# EAGLE design V2_7.7 (EAGLE 7.7.0)
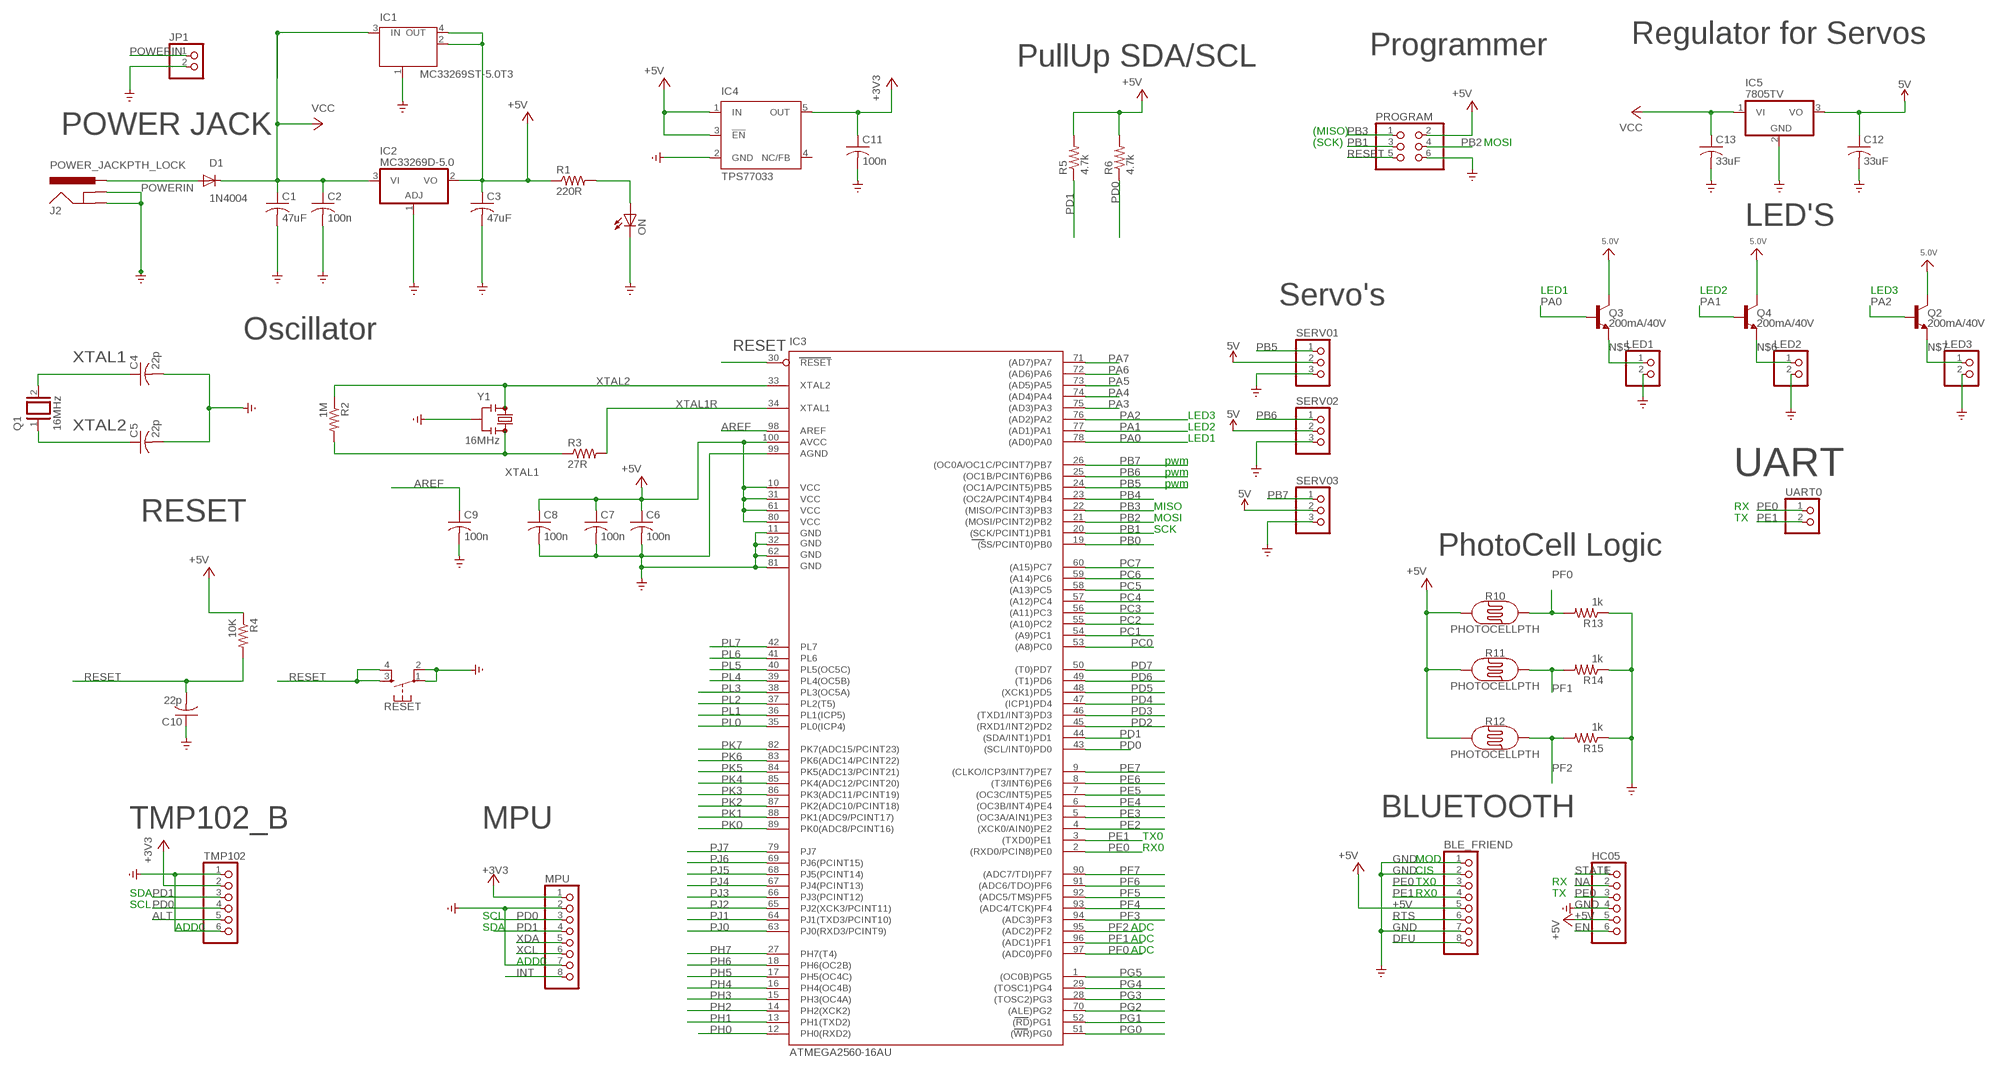
[diagram p0: schematic, sheet 1, part 1 of 2]
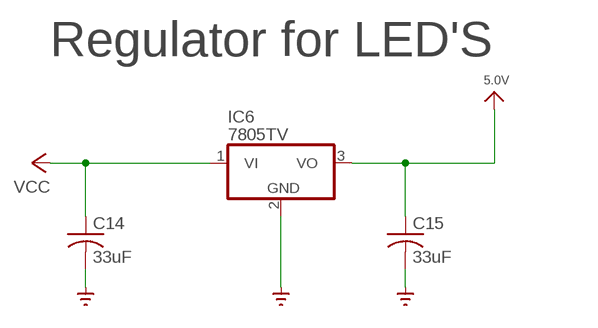
[diagram p1: schematic, sheet 1, part 2 of 2]

## Parts
BLE_FRIEND  PINHD-1X8  [1X08]
C1  47uF  C-US025-024X044  [C025-024X044]
C2  100n  C-US025-024X044  [C025-024X044]
C3  47uF  C-US025-024X044  [C025-024X044]
C4  22p  C-US025-024X044  [C025-024X044]
C5  22p  C-US025-024X044  [C025-024X044]
C6  100n  C-US025-024X044  [C025-024X044]
C7  100n  C-US025-024X044  [C025-024X044]
C8  100n  C-US025-024X044  [C025-024X044]
C9  100n  C-US025-024X044  [C025-024X044]
C10  22p  C-US025-024X044  [C025-024X044]
C11  100n  C-US025-024X044  [C025-024X044]
C12  33uF  C-US025-024X044  [C025-024X044]
C13  33uF  C-US025-024X044  [C025-024X044]
C14  33uF  C-US025-024X044  [C025-024X044]
C15  33uF  C-US025-024X044  [C025-024X044]
D1  1N4004  [DO41-10]
HC05  PINHD-1X6  [1X06]
IC1  MC33269ST-5.0T3  MC33269ST-3.3T3  [SOT223]
IC2  MC33269D-5.0  [DPACK]
IC3  ATMEGA2560-16AU  [TQFP100]
IC4  TPS77033  [SOT23-DBV]
IC5  7805TV  [TO220V]
IC6  7805TV  [TO220V]
J2  POWER_JACKPTH_LOCK  [POWER_JACK_PTH_LOCK]
JP1  PINHD-1X2  [1X02]
LED1  PINHD-1X2  [1X02]
LED2  PINHD-1X2  [1X02]
LED3  PINHD-1X2  [1X02]
MPU  PINHD-1X8  [1X08]
ON  LED3MM  [LED3MM]
PROGRAM  PINHD-2X3  [2X03]
Q1  16MHz  XTAL/S  [QS]
Q2  200mA/40V  TRANS_NPN-2N3904  [TO-92]
Q3  200mA/40V  TRANS_NPN-2N3904  [TO-92]
Q4  200mA/40V  TRANS_NPN-2N3904  [TO-92]
R1  220R  R-US_0204/2V  [0204V]
R2  1M  R-US_0204/2V  [0204V]
R3  27R  R-US_0204/2V  [0204V]
R4  10K  R-US_0204/2V  [0204V]
R5  4.7k  R-US_0204/2V  [0204V]
R6  4.7k  R-US_0204/2V  [0204V]
R10  PHOTOCELLPTH  [PHOTOCELL]
R11  PHOTOCELLPTH  [PHOTOCELL]
R12  PHOTOCELLPTH  [PHOTOCELL]
R13  1k  R-US_0204/2V  [0204V]
R14  1k  R-US_0204/2V  [0204V]
R15  1k  R-US_0204/2V  [0204V]
RESET  MOMENTARY-SWITCH-SPST-2-SMD-5.2MM  [TACTILE_SWITCH_SMD_5.2MM]
SERV01  PINHD-1X3  [1X03]
SERV02  PINHD-1X3  [1X03]
SERV03  PINHD-1X3  [1X03]
TMP102  PINHD-1X6  [1X06]
UART0  PINHD-1X2  [1X02]
Y1  16MHz  RESONATORSMD-3.2X1.3  [RESONATOR-SMD-3.2X1.3]

## Nets
5.0V: C15.1 IC6.3(VO) Q2.3(C) Q3.3(C) Q4.3(C)
5V: C12.1 IC5.3(VO) SERV01.2 SERV02.2 SERV03.2
+3V3: C11.1 IC4.5(OUT) MPU.1 TMP102.2
+5V: BLE_FRIEND.5 C3.1 C6.1 C7.1 C8.1 HC05.5 IC1.2(OUT) IC1.4(OUT) IC2.2(VO) IC3.10(VCC) IC3.31(VCC1) IC3.61(VCC2) IC3.80(VCC3) IC3.100(AVCC) IC4.1(IN) IC4.3(!EN) PROGRAM.2 R1.1 R4.1 R5.2 R6.2 R10.1 R11.1 R12.1
ALT: TMP102.5
AREF: C9.1 IC3.98(AREF)
DFU: BLE_FRIEND.8
EN: HC05.6
GND: BLE_FRIEND.1 BLE_FRIEND.2 BLE_FRIEND.7 C1.2 C2.2 C3.2 C4.2 C5.2 C6.2 C7.2 C8.2 C9.2 C10.1 C11.2 C12.2 C13.2 C14.2 C15.2 HC05.4 IC1.1(GND/ADJ) IC2.1(ADJ) IC3.11(GND) IC3.32(GND1) IC3.62(GND2) IC3.81(GND3) IC3.99(AGND) IC4.2(GND) IC5.2(GND) IC6.2(GND) J2.GND J2.GNDBREAK JP1.2 LED1.2 LED2.2 LED3.2 MPU.2 MPU.7 ON.K(C) PROGRAM.6 R13.1 R14.1 R15.1 RESET.1 RESET.2 SERV01.3 SERV02.3 SERV03.3 TMP102.1 TMP102.6 Y1.2 ; supply symbol labelled GND_
INT: MPU.8
N$3: ON.A R1.2
N$5: LED1.1 Q3.1(E)
N$6: LED2.1 Q4.1(E)
N$7: LED3.1 Q2.1(E)
NA: HC05.2
PA0: IC3.78((AD0)PA0) Q3.2(B)
PA1: IC3.77((AD1)PA1) Q4.2(B)
PA2: IC3.76((AD2)PA2) Q2.2(B)
PA3: IC3.75((AD3)PA3)
PA4: IC3.74((AD4)PA4)
PA5: IC3.73((AD5)PA5)
PA6: IC3.72((AD6)PA6)
PA7: IC3.71((AD7)PA7)
PB0: IC3.19((SS/PCINT0)PB0)
PB1: IC3.20((SCK/PCINT1)PB1) PROGRAM.3
PB2: IC3.21((MOSI/PCINT2)PB2) PROGRAM.4
PB3: IC3.22((MISO/PCINT3)PB3) PROGRAM.1
PB4: IC3.23((OC2A/PCINT4)PB4)
PB5: IC3.24((OC1A/PCINT5)PB5) SERV01.1
PB6: IC3.25((OC1B/PCINT6)PB6) SERV02.1
PB7: IC3.26((OC0A/OC1C/PCINT7)PB7) SERV03.1
PC0: IC3.53((A8)PC0)
PC1: IC3.54((A9)PC1)
PC2: IC3.55((A10)PC2)
PC3: IC3.56((A11)PC3)
PC4: IC3.57((A12)PC4)
PC5: IC3.58((A13)PC5)
PC6: IC3.59((A14)PC6)
PC7: IC3.60((A15)PC7)
PD0: IC3.43((SCL/INT0)PD0) MPU.3 R6.1 TMP102.4
PD1: IC3.44((SDA/INT1)PD1) MPU.4 R5.1 TMP102.3
PD2: IC3.45((RXD1/INT2)PD2)
PD3: IC3.46((TXD1/INT3)PD3)
PD4: IC3.47((ICP1)PD4)
PD5: IC3.48((XCK1)PD5)
PD6: IC3.49((T1)PD6)
PD7: IC3.50((T0)PD7)
PE0: BLE_FRIEND.3 HC05.3 IC3.2((RXD0/PCIN8)PE0) UART0.1
PE1: BLE_FRIEND.4 IC3.3((TXD0)PE1) UART0.2
PE2: IC3.4((XCK0/AIN0)PE2)
PE3: IC3.5((OC3A/AIN1)PE3)
PE4: IC3.6((OC3B/INT4)PE4)
PE5: IC3.7((OC3C/INT5)PE5)
PE6: IC3.8((T3/INT6)PE6)
PE7: IC3.9((CLKO/ICP3/INT7)PE7)
PF0: IC3.97((ADC0)PF0) R10.2 R13.2
PF1: IC3.96((ADC1)PF1) R11.2 R14.2
PF2: IC3.95((ADC2)PF2) R12.2 R15.2
PF3: IC3.94((ADC3)PF3)
PF4: IC3.93((ADC4/TCK)PF4)
PF5: IC3.92((ADC5/TMS)PF5)
PF6: IC3.91((ADC6/TDO)PF6)
PF7: IC3.90((ADC7/TDI)PF7)
PG0: IC3.51((WR)PG0)
PG1: IC3.52((RD)PG1)
PG2: IC3.70((ALE)PG2)
PG3: IC3.28((TOSC2)PG3)
PG4: IC3.29((TOSC1)PG4)
PG5: IC3.1((OC0B)PG5)
PH0: IC3.12(PH0(RXD2))
PH1: IC3.13(PH1(TXD2))
PH2: IC3.14(PH2(XCK2))
PH3: IC3.15(PH3(OC4A))
PH4: IC3.16(PH4(OC4B))
PH5: IC3.17(PH5(OC4C))
PH6: IC3.18(PH6(OC2B))
PH7: IC3.27(PH7(T4))
PJ0: IC3.63(PJ0(RXD3/PCINT9))
PJ1: IC3.64(PJ1(TXD3/PCINT10))
PJ2: IC3.65(PJ2(XCK3/PCINT11))
PJ3: IC3.66(PJ3(PCINT12))
PJ4: IC3.67(PJ4(PCINT13))
PJ5: IC3.68(PJ5(PCINT14))
PJ6: IC3.69(PJ6(PCINT15))
PJ7: IC3.79(PJ7)
PK0: IC3.89(PK0(ADC8/PCINT16))
PK1: IC3.88(PK1(ADC9/PCINT17))
PK2: IC3.87(PK2(ADC10/PCINT18))
PK3: IC3.86(PK3(ADC11/PCINT19))
PK4: IC3.85(PK4(ADC12/PCINT20))
PK5: IC3.84(PK5(ADC13/PCINT21))
PK6: IC3.83(PK6(ADC14/PCINT22))
PK7: IC3.82(PK7(ADC15/PCINT23))
PL0: IC3.35(PL0(ICP4))
PL1: IC3.36(PL1(ICP5))
PL2: IC3.37(PL2(T5))
PL3: IC3.38(PL3(OC5A))
PL4: IC3.39(PL4(OC5B))
PL5: IC3.40(PL5(OC5C))
PL6: IC3.41(PL6)
PL7: IC3.42(PL7)
POWERIN: D1.A J2.PWR JP1.1
RESET: C10.2 IC3.30(RESET) PROGRAM.5 R4.2 RESET.3 RESET.4
RTS: BLE_FRIEND.6
STATE: HC05.1
VCC: C1.1 C2.1 C13.1 C14.1 D1.C IC1.3(IN) IC2.3(VI) IC5.1(VI) IC6.1(VI)
XCL: MPU.6
XDA: MPU.5
XTAL1: C4.1 Q1.2 R2.2 R3.1 Y1.3
XTAL1R: IC3.34(XTAL1) R3.2
XTAL2: C5.1 IC3.33(XTAL2) Q1.1 R2.1 Y1.1
Unconnected: IC4.4(NC/FB)

## Notes on the sheet
- Regulator for Servos | Regulator for LED'S
- Programmer
- PullUp SDA/SCL
- POWER JACK | (MISO)
- (SCK) | MOSI
- LED'S
- LED1 | LED2 | LED3
- Servo's
- Oscillator
- LED3
- LED2
- LED1
- pwm
- pwm | UART
- pwm
- MISO | RX
- RESET | MOSI | TX
- SCK
- PhotoCell Logic
- BLUETOOTH
- TMP102_B | MPU
- TX0
- RX0
- MOD
- CIS
- TX0 | RX
- SDA | RX0 | TX
- SCL
- SCL
- ADD0 | SDA | ADC
- ADC
- ADC
- ADD0

## Library data of the parts
BLE_FRIEND MPU = pinhead:PINHD-1X8: PIN HEADER
C1-C15 = adafruit:C-US: CAPACITOR, American symbol
D1 = adafruit:1N4004: DIODE General purpose 1N400x type rectifier (With bigger pads) http://www.ladyada.net/library/pcb/eaglelibrary.html
HC05 = pinhead@1:PINHD-1X6: PIN HEADER
IC1 = linear:MC33269ST*: Adjustable Output Low Dropout Voltage Regulator 800 mA Source: http://www.onsemi.com/pub/Collateral/MC33269-D.PDF
IC2 = linear:MC33269?*: Adjustable Output Low Dropout Voltage Regulator 800 mA Source: http://www.onsemi.com/pub/Collateral/MC33269-D.PDF
IC3 = atmel-2005:ATMEGA*: MICROCONTROLLER 64/128/256 Kbytes FLASH 4 Kbytes EEPROM 8 Kbytes SRAM 86 General Purpose I/O pins 12-channels16-bit PWM 4 x Serial USARTs 16-channels 10-bit A/D
IC4 = texas:TPS770*: ULTRALOW-POWER 50-mA LOW-DROPOUT LINEAR REGULATORS 50-mA Low-Dropout Regulator Source: http://focus.ti.com/lit/ds/symlink/tps77001.pdf; MF: TEXAS INSTRUMENTS; MPN: TPS77033DBVT; OC_FARNELL: 8461570; OC_NEWARK: 77C1187
IC5 IC6 = linear:78*: Positive VOLTAGE REGULATOR Source: http://cache.national.com/ds/LM/LM78L05.pdf http://www.fairchildsemi.com/ds/LM/LM7805.pdf
J2 = SparkFun-Connectors:POWER_JACK: Power Jack Connector This is the standard 5.5mm barrel jack for power. The PTH is the most common, proven, reliable, footprint. The Slot footprint only works if the mill layer is transmitted to the PCB fab house so be warned. Here are the connectors we sell at SparkFun: DC Barrel Power Jack/Connector <https://www.sparkfun.com/products/119> (PRT-00119) DC Barrel Power Jack/Connector (SMD) <https://www.sparkfun.com/products/12748> (PRT-12748) DC Barrel Jack Adapter - Breadboard Compatible <https://www.sparkfun.com/products/10811> (PRT-10811) It is used on this SparkFun product (and many, many others): SparkFun RedBoard - Programmed with Arduino <https://www.sparkfun.com/products/12757> (DEV-12757) Also, if you need a mating power supply or connector, please check these out: Wall Adapter Power Supply - 9VDC 650mA <https://www.sparkfun.com/products/298> (TOL-00298) DC Barrel Jack Adapter - Male <https://www.sparkfun.com/products/10287> (PRT-10287); PROD_ID: CONN-08197; SF_ID: PRT-00119
JP1 = pinhead@1:PINHD-1X2: PIN HEADER
LED1-LED3 UART0 = pinhead:PINHD-1X2: PIN HEADER
ON = adafruit:LED: LED OSRAM: - CHIPLED LG R971, LG N971, LY N971, LG Q971, LY Q971, LO R971, LY R971 LH N974, LH R974 LS Q976, LO Q976, LY Q976 LO Q996 - Hyper CHIPLED LW Q18S LB Q993, LB Q99A, LB R99A - SideLED LS A670, LO A670, LY A670, LG A670, LP A670 LB A673, LV A673, LT A673, LW A673 LH A674 LY A675 LS A676, LA A676, LO A676, LY A676, LW A676 LS A679, LY A679, LG A679 - Hyper Micro SIDELED® LS Y876, LA Y876, LO Y876, LY Y876 LT Y87S - SmartLED LW L88C, LW L88S LB L89C, LB L89S, LG L890 LS L89K, LO L89K, LY L89K LS L896, LA L896, LO L896, LY L896 - TOPLED LS T670, LO T670, LY T670, LG T670, LP T670 LSG T670, LSP T670, LSY T670, LOP T670, LYG T670 LG T671, LOG T671, LSG T671 LB T673, LV T673, LT T673, LW T673 LH T674 LS T676, LA T676, LO T676, LY T676, LB T676, LH T676, LSB T676, LW T676 LB T67C, LV T67C, LT T67C, LS T67K, LO T67K, LY T67K, LW E67C LS E67B, LA E67B, LO E67B, LY E67B, LB E67C, LV E67C, LT E67C LW T67C LS T679, LY T679, LG T679 LS T770, LO T770, LY T770, LG T770, LP T770 LB T773, LV T773, LT T773, LW T773 LH T774 LS E675, LA E675, LY E675, LS T675 LS T776, LA T776, LO T776, LY T776, LB T776 LHGB T686 LT T68C, LB T68C - Hyper Mini TOPLED® LB M676 - Mini TOPLED Santana® LG M470 LS M47K, LO M47K, LY M47K Source: http://www.osram.convergy.de/
PROGRAM = pinhead:PINHD-2X3: PIN HEADER
Q1 = special:XTAL/S: CRYSTAL
Q2-Q4 = SparkFun-DiscreteSemi:TRANS_NPN: NPN transistor Current controlled devices typically used to amplify current or used as a switch. BC547 - COM-08928 <http://www.sparkfun.com/products/8928> (TO-92 45V 100mA) (1.Collector 2.Base 3.Emitter) 2N3904 - COM-00521 <http://www.sparkfun.com/products/521> (TO-92 40V 200mA) (1.Emitter 2.Base 3.Collector) P2N2222A - COM-12852 <http://www.sparkfun.com/products/12852> (TO-92 40V 600mA) (1.Collector 2.Base 3.Emitter); PROD_ID: TRANS-08447
R1-R6 R13-R15 = resistor:R-US_: RESISTOR, American symbol
R10-R12 = SparkFun-Sensors:PHOTOCELL: Photocell (Photodetector, Photo Resistor, CdS) This is a very small light sensor. A photocell changes (also called a photodetector, photo resistor, CdS or photoconductive cell) resistance depending on the amount of light it is exposed to. These little sensors make great ambient light triggers (when light in the room turns on, do something). Datasheet <http://cdn.sparkfun.com/datasheets/Sensors/LightImaging/SEN-09088.pdf> SparkFun Products Mini Photocell <https://www.sparkfun.com/products/9088> (SEN-09088); PROD_ID: COMP-09129; SF_ID: SEN-09088
RESET = SparkFun-Switches:MOMENTARY-SWITCH-SPST-2: Momentary Switch (Pushbutton) - SPST - Two Circuits Normally-open (NO) SPST momentary switches (buttons, pushbuttons). Schematic symbol includes two switch circuits. Variants SMD-4.6MMX2.8MM - 4.60mm x 2.80mm Tactile Momentary Button Switch - Used on SparkFun SAMD21 Mini Breakout <https://www.sparkfun.com/products/13664> SMD-5.2MM - Mini Pushbutton Switch - SMD <https://www.sparkfun.com/products/8720> - Used on Arduino Pro Mini <https://www.sparkfun.com/products/11114>; PROD_ID: SWCH-08247; SF_SKU: COM-08720
SERV01-SERV03 = pinhead:PINHD-1X3: PIN HEADER
TMP102 = pinhead:PINHD-1X6: PIN HEADER
Y1 = SparkFun-Clocks:RESONATOR: Resonators (Generic) Ceramic resonators are clock-generating components, often used to control timing in microcontrollers. They usually have 3 pins: two pins for oscillation, and one pin for ground. Compared to crystals, resonators have worse tolerance, but are usually much cheaper. Plus, they have built-in load capacitors! These devices are used on boards like the Arduino Pro 8MHz <https://www.sparkfun.com/products/11114> and Arduino Pro 16MHz <https://www.sparkfun.com/products/11113>.

## Net classes
0 default: width 0.15 mm, drill 0.3 mm, clearance 0.15 mm

## Board
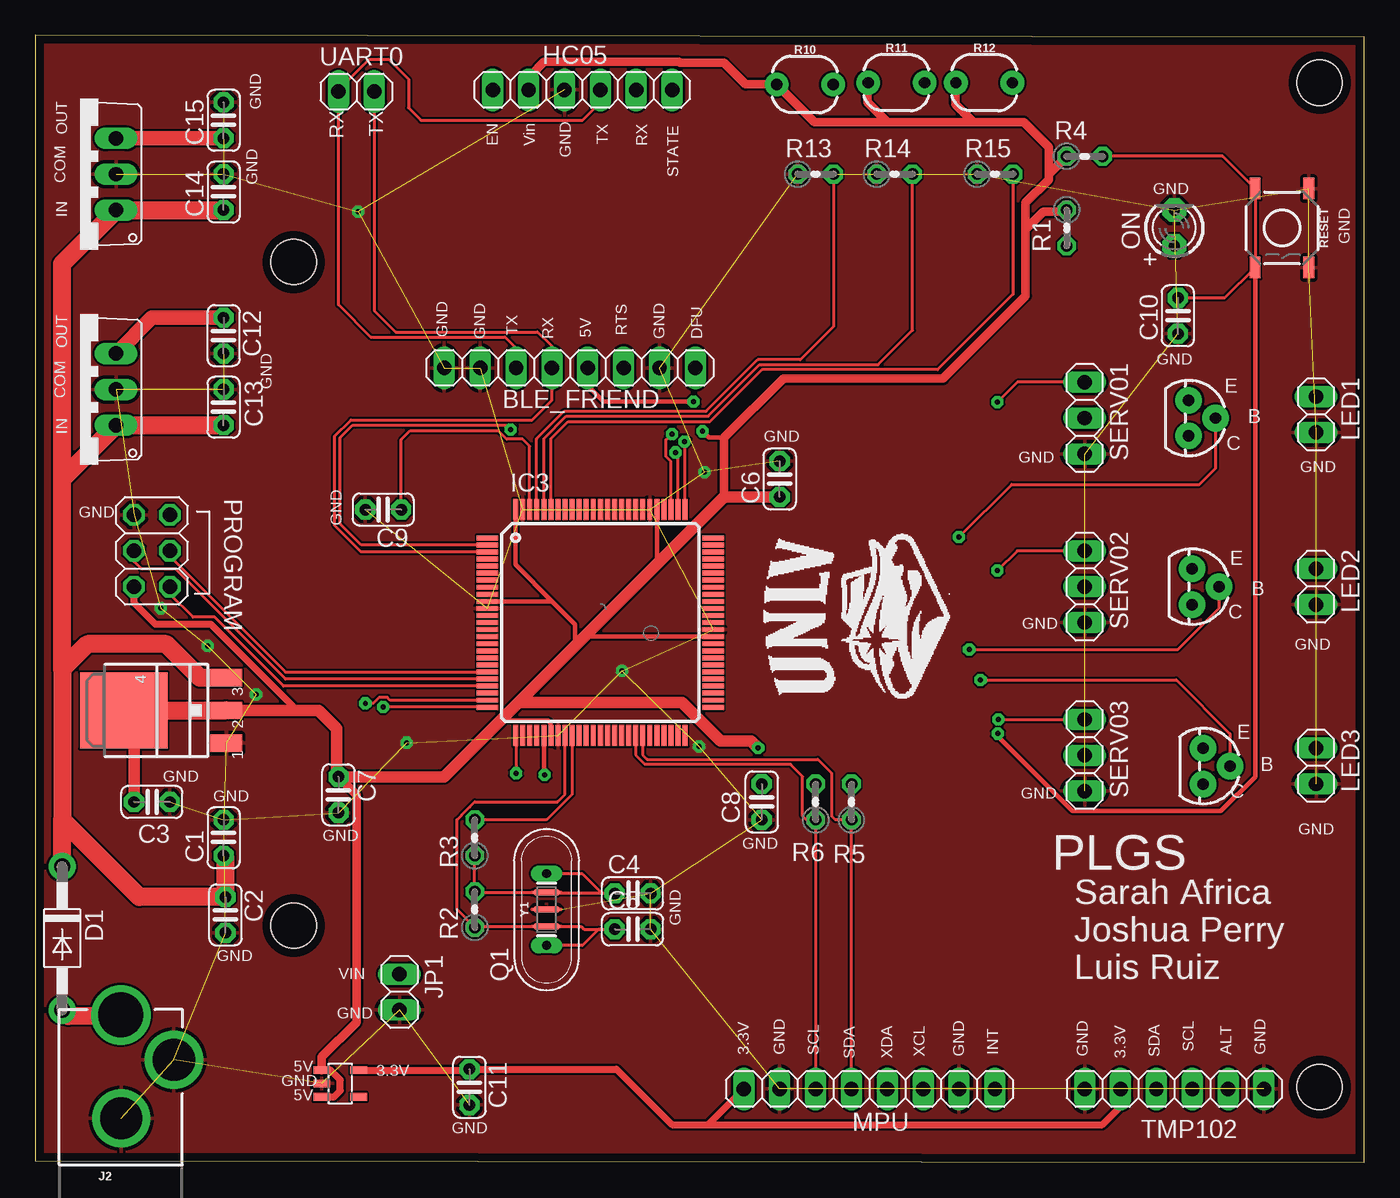
[diagram p2: board, top side]
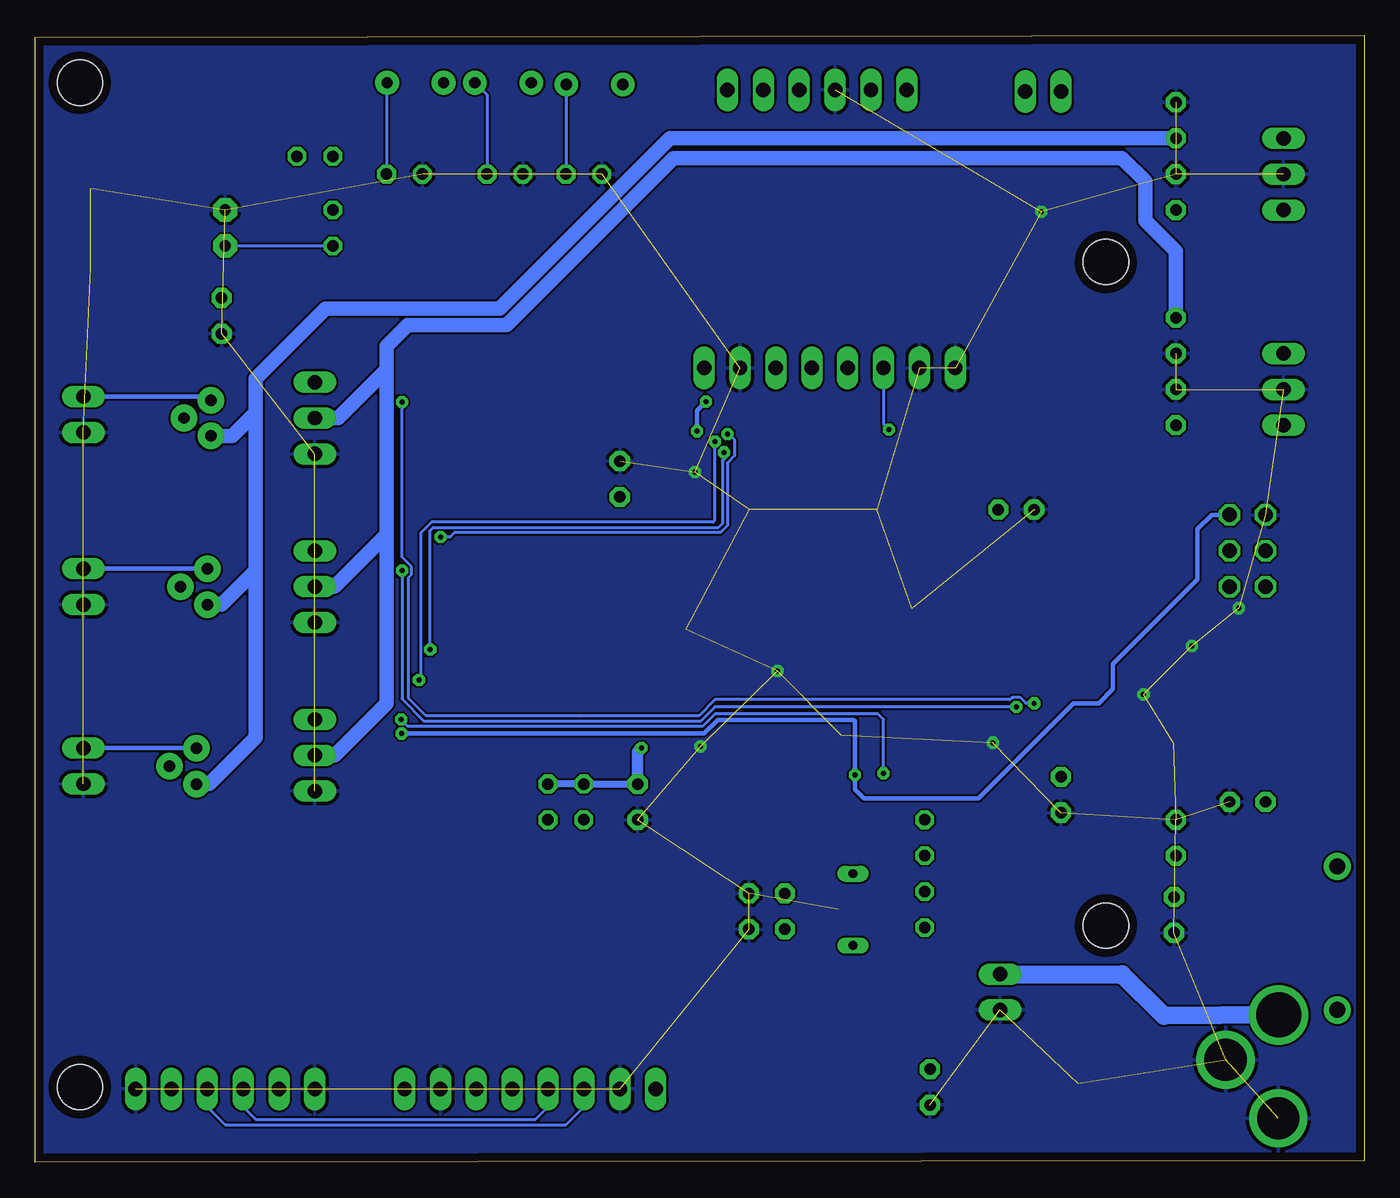
[diagram p3: board, bottom side, seen from below]

Size 94.09 x 79.81 mm. Coordinates in mm from the lower left corner, seen from the top.
Outline: 0,0.13 94.09,0 94.09,79.68 0,79.81 0,0.13
Copper layers (1*16): Top 0.035mm / dielectric 1.5mm / Bottom 0.035mm
Design rules "default *": minimum track width 0.15mm, minimum drill 0.3mm, track to track 0.15mm, track to pad 0.15mm, pad to pad 0.15mm, via to via 0.15mm, smd to smd 0.15mm, copper to edge 0.6mm, drill to drill 0.3mm, minimum pad ring 10mil, minimum via ring 10mil, stop-mask expansion 2mil, vias tented up to drill 1mil, thermal gap 10mil
Holes 3.2 mm at 90.93,76.45 90.93,5.33 18.29,63.75 18.29,16.76

### Footprints (pad centres in the part's own frame; a part is rotated, then mirrored left to right if it is on the bottom)
1X08 = drill 1.016 long: 1 -8.89,0; 2 -6.35,0; 3 -3.81,0; 4 -1.27,0; 5 1.27,0; 6 3.81,0; 7 6.35,0; 8 8.89,0
C025-024X044 = drill 0.813 pad 1.422 octagon: 1 -1.27,0; 2 1.27,0
DO41-10 = drill 1.118 pad 1.93: A 5.08,0; C -5.08,0
1X06 = drill 1.016 long: 1 -6.35,0; 2 -3.81,0; 3 -1.27,0; 4 1.27,0; 5 3.81,0; 6 6.35,0
SOT223 = smd 1.219 x 2.235: 1 -2.311,-3.099; 2 0,-3.099; 3 2.311,-3.099 | smd 3.6 x 2.2: 4 0,3.099
DPACK = smd 1 x 1.6: 1 -2.28,-4.8; 3 2.28,-4.8 | smd 5.4 x 6.2: 2 0,2.5
TQFP100 = smd 1.5 x 0.35: 1 -8,6; 2 -8,5.5; 3 -8,5; 4 -8,4.5; 5 -8,4; 6 -8,3.5; 7 -8,3; 8 -8,2.5; 9 -8,2; 10 -8,1.5; 11 -8,1; 12 -8,0.5; 13 -8,0; 14 -8,-0.5; 15 -8,-1; 16 -8,-1.5; 17 -8,-2; 18 -8,-2.5; 19 -8,-3; 20 -8,-3.5; 21 -8,-4; 22 -8,-4.5; 23 -8,-5; 24 -8,-5.5; 25 -8,-6; 51 8,-6; 52 8,-5.5; 53 8,-5; 54 8,-4.5; 55 8,-4; 56 8,-3.5; 57 8,-3; 58 8,-2.5; 59 8,-2; 60 8,-1.5; 61 8,-1; 62 8,-0.5; 63 8,0; 64 8,0.5; 65 8,1; 66 8,1.5; 67 8,2; 68 8,2.5; 69 8,3; 70 8,3.5; 71 8,4; 72 8,4.5; 73 8,5; 74 8,5.5; 75 8,6 | smd 0.35 x 1.5: 26 -6,-8; 27 -5.5,-8; 28 -5,-8; 29 -4.5,-8; 30 -4,-8; 31 -3.5,-8; 32 -3,-8; 33 -2.5,-8; 34 -2,-8; 35 -1.5,-8; 36 -1,-8; 37 -0.5,-8; 38 0,-8; 39 0.5,-8; 40 1,-8; 41 1.5,-8; 42 2,-8; 43 2.5,-8; 44 3,-8; 45 3.5,-8; 46 4,-8; 47 4.5,-8; 48 5,-8; 49 5.5,-8; 50 6,-8; 76 6,8; 77 5.5,8; 78 5,8; 79 4.5,8; 80 4,8; 81 3.5,8; 82 3,8; 83 2.5,8; 84 2,8; 85 1.5,8; 86 1,8; 87 0.5,8; 88 0,8; 89 -0.5,8; 90 -1,8; 91 -1.5,8; 92 -2,8; 93 -2.5,8; 94 -3,8; 95 -3.5,8; 96 -4,8; 97 -4.5,8; 98 -5,8; 99 -5.5,8; 100 -6,8
SOT23-DBV = smd 0.55 x 1.2: 1 -0.95,-1.3; 2 0,-1.3; 3 0.95,-1.3; 4 0.95,1.3; 5 -0.95,1.3
TO220V = drill 1.016 long: 1 -2.54,-2.54; 2 0,-2.54; 3 2.54,-2.54
POWER_JACK_PTH_LOCK = drill 2.997 pad 4.115: GND 0.025,6.557; GNDBREAK 3.762,10.7 | drill 3.2 pad 4.115: PWR 0,13.878
1X02 = drill 1.016 long: 1 -1.27,0; 2 1.27,0
LED3MM = drill 0.813 pad 1.676 octagon: A -1.27,0; K 1.27,0
2X03 = drill 1.016 octagon: 1 -2.54,-1.27; 2 -2.54,1.27; 3 0,-1.27; 4 0,1.27; 5 2.54,-1.27; 6 2.54,1.27
QS = drill 0.61 long: 1 -2.54,0; 2 2.54,0
TO-92 = drill 0.813 pad 1.88: 1 -1.27,0; 2 0,1.905; 3 1.27,0
0204V = drill 0.813 octagon: 1 -1.27,0; 2 1.27,0
PHOTOCELL = drill 0.8 pad 1.676: 1 -2,0; 2 2,0
TACTILE_SWITCH_SMD_5.2MM = smd 1.524 x 0.762: 1 -2.794,1.905; 2 2.794,1.905; 3 -2.794,-1.905; 4 2.794,-1.905
1X03 = drill 1.016 long: 1 -2.54,0; 2 0,0; 3 2.54,0
RESONATOR-SMD-3.2X1.3 = smd 0.45 x 1.905: 1 -1.2,0; 2 0,0; 3 1.2,0

### Placement (x,y rotation side)
BLE_FRIEND  37.85,56.26 0 top
C1  13.33,22.99 90 top
C2  13.46,17.53 270 top
C3  8.25,25.53 0 top
C4  42.29,19.05 0 top
C5  42.29,16.51 0 top
C6  52.7,48.39 90 top
C7  21.46,26.04 270 top
C8  51.44,25.53 270 top
C9  24.64,46.23 180 top
C10  80.9,59.94 90 top
C11  30.73,5.33 270 top
C12  13.33,58.55 270 top
C13  13.33,53.47 90 top
C14  13.33,68.71 90 top
C15  13.33,73.79 90 top
D1  1.91,15.88 270 top
HC05  38.73,75.95 180 top
IC1  10.41,32 90 top
IC2  8.76,32 90 top
IC3  40.01,38.23 0 top
IC4  21.59,5.59 270 top
IC5  3.17,54.74 90 top
IC6  3.17,69.98 90 top
J2  6.05,-3.43 0 top
JP1  25.78,12.06 270 top
LED1  90.68,52.96 270 top
LED2  90.68,40.77 270 top
LED3  90.68,28.07 270 top
MPU  59.05,5.21 0 top
ON  80.64,66.17 90 top
PROGRAM  8.25,43.31 90 top
Q1  36.2,17.91 90 top
Q2  82.68,28.07 270 top
Q3  81.66,52.7 270 top
Q4  81.92,40.77 270 top
R1  73.03,66.17 270 top
R2  31.12,17.91 90 top
R3  31.12,22.99 90 top
R4  74.3,71.25 0 top
R5  57.79,25.53 90 top
R6  55.25,25.53 90 top
R10  54.48,76.33 0 top
R11  60.96,76.45 0 top
R12  67.18,76.45 0 top
R13  55.25,69.98 0 top
R14  60.83,69.98 0 top
R15  67.95,69.98 0 top
RESET  88.27,66.17 270 top
SERV01  74.3,52.7 270 top
SERV02  74.3,40.77 270 top
SERV03  74.3,28.83 270 top
TMP102  80.64,5.21 0 top
UART0  22.73,75.82 0 top
Y1  36.2,17.91 90 top

### Tracks (layer width: path | path; a pad name or v marks a point on that pad's centre or on a via)
5.0V
  Top 1.016: IC6.3 C15.1
  Bottom 1.016: C15.1 49.15,72.52 61.21,60.45 73.53,60.45 78.49,55.5 78.49,53.09 | 78.49,41.91 78.49,30.1 81.79,26.8 Q2.3 | 78.49,53.09 78.49,41.91 | Q4.3 80.9,39.5 78.49,41.91 | Q3.3 80.14,51.44 78.49,53.09
5V
  Top 1.016: IC5.3 8.25,59.82 C12.1
  Bottom 1.016: C12.1 13.33,64.52 15.49,66.67 15.49,69.47 17.14,71.12 48.9,71.12 60.73,59.29 67.71,59.29 69.22,57.78 69.22,56.13 | 69.22,44.45 69.22,32.51 72.9,28.83 SERV03.2 | 69.22,56.13 69.22,44.45 | SERV02.2 72.9,40.77 69.22,44.45 | SERV01.2 72.64,52.7 69.22,56.13
+3V3
  Top 0.508: TMP102.2 76.84,3.94 75.56,2.67 47.62,2.67 | MPU.1 47.62,2.67 | 47.62,2.67 45.09,2.67 41.91,5.84 | 41.91,5.84 41.27,6.48 | 41.91,5.84 41.15,6.6 C11.1 30.67,6.54 IC4.5
+5V  (via drill 0.35)
  Top 0.305: 36.6,39.73 IC3.10 | 36.6,39.73 38.23,38.1 38.23,36.58 37.97,36.32 | IC3.80 44.01,42.36 44.01,42.35 | IC3.100 34.01,42.32 36.6,39.73 | IC3.61 38.88,37.23 38.73,37.08 | IC3.31 36.48,30.25 36.48,31.1 36.3,31.28 33.24,31.28 33.08,31.43 | BLE_FRIEND.5 39.12,54.99 40.24,53.87 v46.6,53.87 | 48.77,51.31 47.71,51.31 v47.24,51.77
  Top 0.508: IC4.1 20.89,6.54 21.59,5.84 21.59,5.08 21.15,4.64 IC4.3 | 19.43,32 18.54,32 12.45,38.1 8.51,38.1 6.99,39.62 PROGRAM.2
  Top 0.61: 48.77,47.12 48.77,51.31 52.96,55.5 64.26,55.5 70.1,61.34 70.1,66.04 | 70.1,66.04 71.37,67.31 72.9,67.31 R1.1 | 70.1,66.04 70.1,67.95 71.75,69.6 71.75,69.98 | 71.75,69.98 71.75,71.88 69.98,73.66 66.42,73.66 | 66.42,73.66 60.33,73.66 | 60.33,73.66 55.15,73.66 R10.1 50.29,76.33 48.77,77.85 45.66,77.85 45.59,77.92 36.02,77.92 35.05,76.96 35.05,76.07 HC05.5 | 60.33,73.66 58.93,75.06 58.93,76.42 R11.1 | 66.42,73.66 65.15,74.93 65.15,76.42 R12.1 | R4.1 71.75,69.98 | C7.1 22.73,26.04 22.73,9.91 20.29,7.46 IC4.1
  Top 0.813: IC1.2 19.43,32 20.07,32 21.34,30.73 21.34,27.43 C7.1 28.96,27.3 33.08,31.43 34.23,32.58 | C6.1 48.77,47.12 44.01,42.35 38.73,37.08 37.97,36.32 34.23,32.58 | 34.23,32.58 45.78,32.58 48.51,29.85 50.67,29.85 v51.18,29.34 | C3.1 6.99,31.88 6.86,32 IC1.4
  Top 1.27: IC2.2 6.86,32 IC1.2
  Bottom 0.305: v47.24,51.77 47.24,53.22 v46.6,53.87
  Bottom 0.508: C8.1 R6.2 R5.2
  Bottom 0.813: C8.1 51.44,29.08 v51.18,29.34
AREF
  Top 0.203: C9.1 25.91,51.18 26.54,51.82 32.77,51.82 33.37,51.22 34.51,51.22 35.01,50.72 IC3.98
GND  (via drill 0.35)  (57 unrouted)
  other vias: 26.29,29.72 41.53,34.8 46.99,29.46 12.19,36.58 15.62,33.15 8.89,39.24 47.37,48.89 22.86,67.31
  pour Bottom: 0,80.01 94.11,80.01 94.11,-0.25 0,-0.25
  pour Top: 0,80.01 94.11,80.01 94.11,-0.25 0,-0.25
N$3
  Bottom 0.203: ON.A R1.2
N$5
  Bottom 0.305: LED1.1 81.92,54.23 Q3.1
N$6
  Bottom 0.305: LED2.1 Q4.1
N$7
  Bottom 0.305: Q2.1 LED3.1
PA0  (via drill 0.35)
  Top 0.203: IC3.78 45.01,49.64 44.64,50 44.64,51.15 v45.07,51.58 | v65.41,44.28 69.13,48.01 82.42,48.01 83.57,49.15 Q3.2
  Bottom 0.203: v45.07,51.58 44.97,51.58 44.58,51.18 44.58,50.04 45.09,49.53 45.09,45.08 45.57,44.61 64.39,44.61 64.72,44.28 v65.41,44.28
PA1  (via drill 0.35)
  Top 0.203: IC3.77 45.51,50.1 v45.32,50.28 | v66.12,36.32 80.9,36.32 83.82,39.24 Q4.2
  Bottom 0.203: v45.32,50.28 45.32,49.79 45.44,49.68 45.44,45.24 45.72,44.96 65.91,44.96 66.12,44.75 v66.12,36.32
PA2  (via drill 0.35)
  Top 0.203: IC3.76 46.01,51.02 v45.97,51.05 | v66.93,34.16 80.77,34.16 84.58,30.35 Q2.2
  Bottom 0.203: v45.97,51.05 45.97,50.59 46.01,50.56 46.01,45.44 46.1,45.34 66.04,45.34 66.8,44.58 66.8,34.29 v66.93,34.16
PB1
  Top 0.203: IC3.20 17.72,34.73 9.53,42.93 PROGRAM.3
PB2
  Top 0.203: PROGRAM.4 6.99,42.55 7.49,42.04 9.91,42.04 17.72,34.23 IC3.21
PB3
  Top 0.203: PROGRAM.1 9.53,40.26 11.18,38.61 12.7,38.61 17.58,33.73 IC3.22
PB5  (via drill 0.35)
  Top 0.203: v23.37,32.51 23.93,32.51 24.36,32.94 24.92,32.94 25.13,32.73 IC3.24 | SERV01.1 69.53,55.25 v68.13,53.85
  Bottom 0.203: v23.37,32.51 23.96,32.51 23.96,32.54 24.36,32.94 24.92,32.94 25.09,32.77 45.96,32.77 47.11,31.61 55.51,31.61 | 55.51,31.61 55.53,31.59 | 55.51,31.61 66.41,31.61 67.69,32.89 67.69,41.38 67.45,41.63 67.45,42.19 68.13,42.87 v68.13,53.85
PB6  (via drill 0.35)
  Top 0.203: IC3.25 31.97,32.26 v24.64,32.26 | SERV02.1 69.53,43.31 v68.13,41.91
  Bottom 0.203: v24.64,32.26 45.97,32.26 46.99,31.24 66.54,31.24 68.13,32.82 v68.13,41.91
PB7  (via drill 0.35)
  Top 0.203: IC3.26 34.04,30.2 v34.04,27.56 | v68.2,31.37 SERV03.1
  Bottom 0.203: v34.04,27.56 34.04,31.37 34.42,31.75 45.97,31.75 46.84,30.89 67.72,30.89 v68.2,31.37
PD0
  Top 0.203: MPU.3 R6.1 54.61,24.26 54.33,24.53 54.33,27.33 53.47,28.19 43.18,28.19 42.51,28.87 IC3.43
  Bottom 0.203: TMP102.4 81.92,3.94 80.64,2.67 56.52,2.67 55.25,3.94 MPU.3
PD1
  Top 0.203: MPU.4 R5.1 56.64,24.26 56.39,24.51 56.39,27.56 55.4,28.55 43.33,28.55 43.01,28.87 IC3.44
  Bottom 0.203: MPU.4 57.79,3.94 58.7,3.02 78.46,3.02 79.38,3.94 TMP102.3
PE0  (via drill 0.35)
  Top 0.203: IC3.2 23.08,43.73 21.59,45.21 21.59,51.32 22.48,52.2 33.35,52.2 v33.66,51.9 | BLE_FRIEND.3 34.04,57.66 33.25,58.45 23.75,58.45 21.46,60.73 UART0.1 21.46,75.95 23.62,78.11 25.02,78.11 26.42,76.71 26.42,74.68 27.3,73.79 38.73,73.79 40.01,75.06 HC05.3
  Bottom 0.203: BLE_FRIEND.3 34.04,52.28 v33.66,51.9
PE1
  Top 0.203: IC3.3 23.07,43.23 21.21,45.08 21.21,51.44 22.35,52.58 35.18,52.58 36.58,53.98 BLE_FRIEND.4 36.58,57.78 35.56,58.8 25.53,58.8 24,60.33 UART0.2
PF0
  Top 0.203: R13.2 56.52,59.18 54.17,56.84 51.14,56.84 47.49,53.19 37.45,53.19 35.51,51.25 IC3.97
  Bottom 0.203: R13.2 56.48,70.01 R10.2
PF1
  Top 0.203: IC3.96 36.01,51.25 37.59,52.83 47.63,52.83 51.29,56.49 59.66,56.49 62.1,58.93 R14.2
  Bottom 0.203: R11.2 62.1,75.6 R14.2
PF2
  Top 0.203: R15.2 69.22,61.47 63.88,56.13 51.44,56.13 47.75,52.45 37.72,52.45 36.51,51.24 IC3.95
  Bottom 0.203: R15.2 69.18,70.01 R12.2
POWERIN
  Top 1.27: J2.PWR 2.34,10.36 D1.A
  Bottom 1.27: JP1.1 17.14,13.34 14.17,10.36 J2.PWR
RESET  (via drill 0.35)
  Top 0.203: R4.2 84.07,71.25 RESET.3 RESET.4 84.2,61.21 C10.2
  Top 0.305: RESET.4 86.36,27.3 83.95,24.89 73.42,24.89 68.15,30.16 v68.15,30.36 | IC3.30 36.01,27.5 v36.07,27.43
  Bottom 0.305: v68.15,30.36 46.73,30.36 45.74,31.35 36.17,31.35 36.07,31.24 v36.07,27.43 36.07,26.42 35.43,25.78 27.3,25.78 20.57,32.51 18.8,32.51 17.78,33.53 17.78,35.31 11.81,41.28 11.81,44.83 10.79,45.85 PROGRAM.5
VCC
  Top 1.016: IC1.3 13.53,34.31 IC2.3
  Top 1.27: C1.1 13.46,21.59 C2.1 7.37,18.8 1.91,24.26 | 1.91,34.92 1.91,24.26 | 1.91,34.92 1.91,48.39 | 1.91,48.39 IC5.1 C13.1 | 1.91,48.39 1.91,63.63 IC6.1 C14.1 | D1.C 1.91,24.26 | IC1.3 11.66,34.31 9.27,36.7 3.68,36.7 1.91,34.92
XTAL1
  Top 0.203: C4.1 40.13,19.05 | 40.13,19.05 38.73,20.45 Q1.2 | 40.13,19.05 36.25,19.05 Y1.3 31.19,19.11 R2.2 R3.1
XTAL1R
  Top 0.203: R3.2 36.2,24.26 38.01,26.07 IC3.34
XTAL2
  Top 0.203: Q1.1 38.73,15.37 39.88,16.51 40.01,16.51 | 40.01,16.51 C5.1 | 40.01,16.51 38.86,16.51 38.66,16.71 Y1.1 31.19,16.71 R2.1 29.85,17.91 29.85,24.26 30.2,24.61 30.2,24.64 30.74,25.17 30.76,25.17 31.12,25.53 36.97,25.53 37.51,26.07 IC3.33

### Text on the board
tPlace: EN | Vin | GND | TX | RX | STATE
tNames: GND | OUT | RX | TX | COM | GND | GND | IN | GND | GND | GND | TX | RX | 5V | RTS | GND | DFU | OUT | GND | GND | E | COM | B | IN | GND | GND | C | GND | GND | GND | E | B | GND | C | GND | E | B | GND | GND | GND | C | PLGS | GND | GND | GND | GND | GND | VIN | Sarah Africa / Joshua Perry / Luis Ruiz | GND | 3.3V | GND | SCL | SDA | XDA | XCL | GND | INT | GND | 3.3V | SDA | SCL | ALT | GND | 5V | GND | 3.3V | 5V | GND